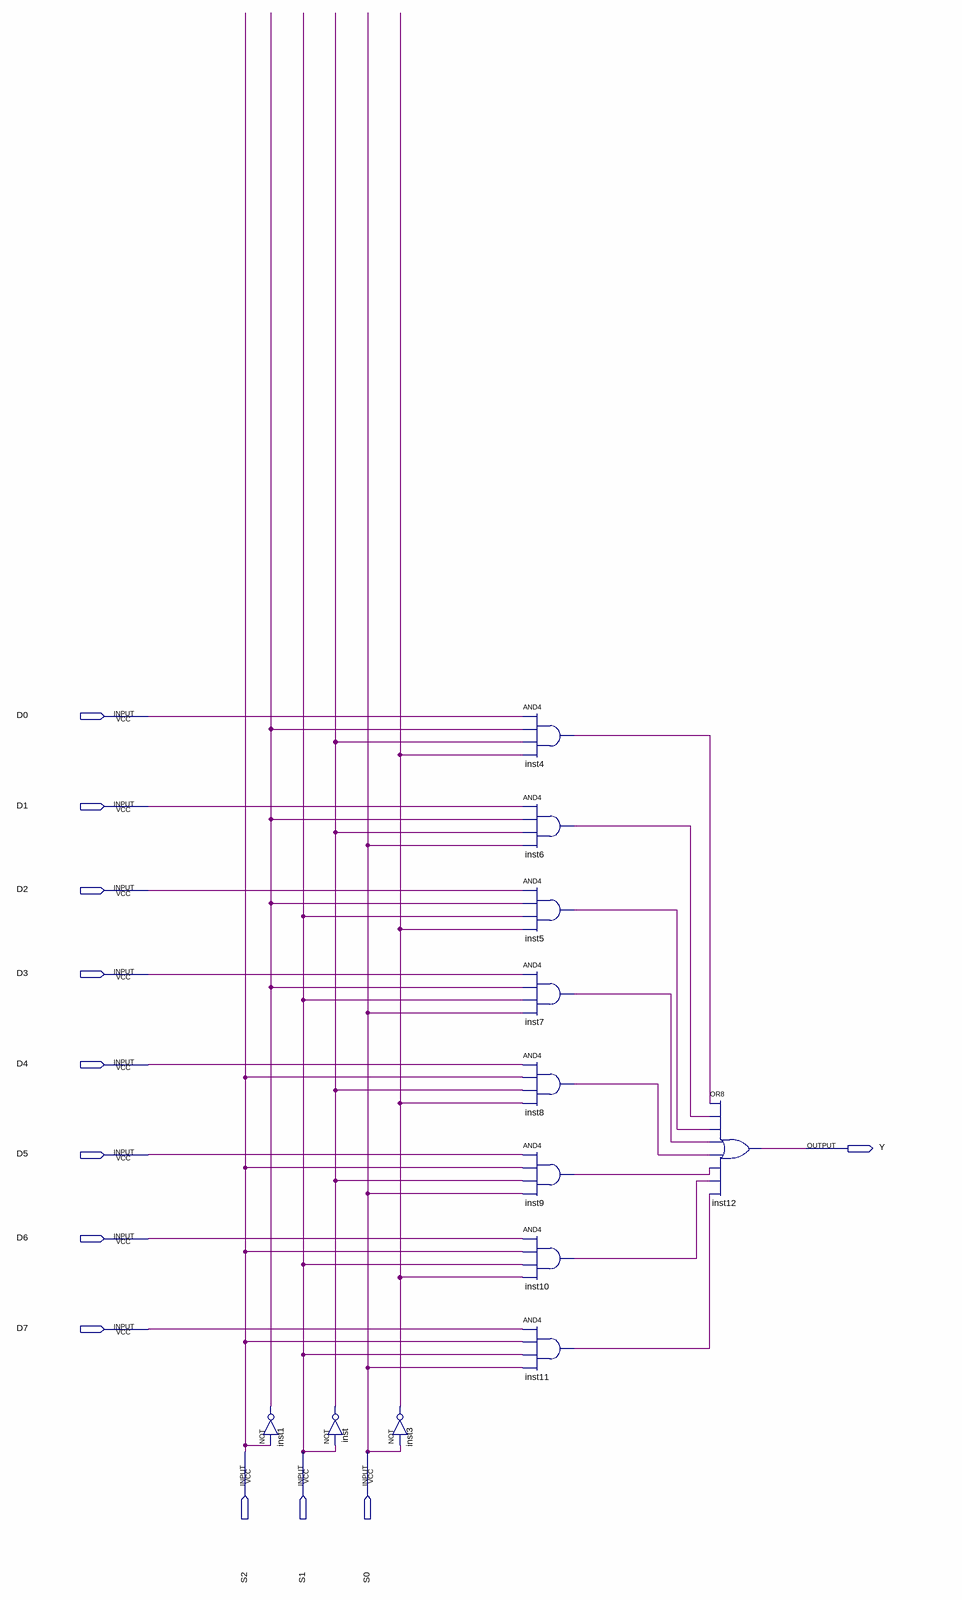
[diagram p0: schematic sheet]
// Quartus schematic mux_8x1_1bit.bdf as structural Verilog: 12 symbols, 12 pins
module mux_8x1_1bit (
  input  D0,
  input  D1,
  input  D2,
  input  D3,
  input  D4,
  input  D5,
  input  D6,
  input  D7,
  input  S2,
  input  S1,
  input  S0,
  output Y
);

  wire inst1_out, inst3_out, inst4_out, inst5_out, inst6_out, inst7_out, inst8_out, inst9_out, inst10_out,
       inst11_out, inst_out;

  not inst1 (inst1_out, S2);
  not inst (inst_out, S1);
  not inst3 (inst3_out, S0);
  and inst4 (inst4_out, D0, inst1_out, inst_out, inst3_out);
  and inst6 (inst6_out, D1, inst1_out, inst_out, S0);
  and inst5 (inst5_out, D2, inst1_out, S1, inst3_out);
  and inst7 (inst7_out, D3, inst1_out, S1, S0);
  and inst8 (inst8_out, D4, S2, inst_out, inst3_out);
  and inst9 (inst9_out, D5, S2, inst_out, S0);
  and inst10 (inst10_out, D6, S2, S1, inst3_out);
  and inst11 (inst11_out, D7, S2, S1, S0);
  or inst12 (Y, inst4_out, inst6_out, inst5_out, inst7_out, inst8_out, inst9_out, inst10_out, inst11_out);
endmodule
